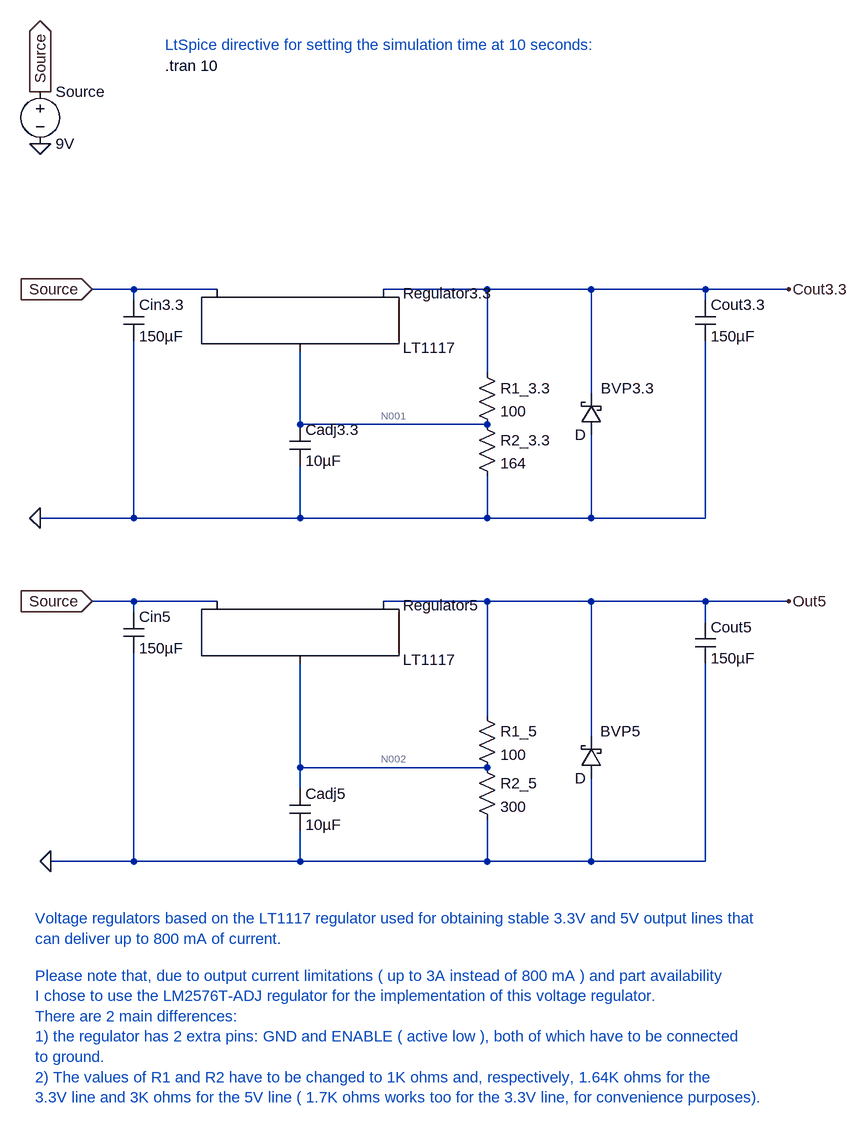
[diagram p0: schematic Voltage Regulator Model.asc]
Voltage Regulator Model.asc, the LTspice schematic file:
Version 4
SHEET 1 1356 680
WIRE 96 -592 32 -592
WIRE 224 -592 96 -592
WIRE 640 -592 480 -592
WIRE 800 -592 640 -592
WIRE 976 -592 800 -592
WIRE 1104 -592 976 -592
WIRE 96 -576 96 -592
WIRE 976 -576 976 -592
WIRE 640 -464 640 -592
WIRE 800 -432 800 -592
WIRE 352 -384 352 -496
WIRE 640 -384 352 -384
WIRE 96 -240 96 -512
WIRE 96 -240 -48 -240
WIRE 352 -240 352 -320
WIRE 352 -240 96 -240
WIRE 640 -240 640 -304
WIRE 640 -240 352 -240
WIRE 800 -240 800 -368
WIRE 800 -240 640 -240
WIRE 976 -240 976 -512
WIRE 976 -240 800 -240
WIRE 96 -112 32 -112
WIRE 224 -112 96 -112
WIRE 640 -112 480 -112
WIRE 800 -112 640 -112
WIRE 976 -112 800 -112
WIRE 1104 -112 976 -112
WIRE 96 -96 96 -112
WIRE 976 -80 976 -112
WIRE 640 64 640 -112
WIRE 800 96 800 -112
WIRE 352 144 352 -16
WIRE 640 144 352 144
WIRE 352 176 352 144
WIRE 96 288 96 -32
WIRE 96 288 -32 288
WIRE 352 288 352 240
WIRE 352 288 96 288
WIRE 640 288 640 224
WIRE 640 288 352 288
WIRE 800 288 800 160
WIRE 800 288 640 288
WIRE 976 288 976 -16
WIRE 976 288 800 288
FLAG 1104 -592 Cout3.3
FLAG -48 -816 0
FLAG -48 -896 Source
IOPIN -48 -896 Out
FLAG 32 -592 Source
IOPIN 32 -592 In
FLAG -48 -240 0
FLAG 32 -112 Source
IOPIN 32 -112 In
FLAG -32 288 0
FLAG 1104 -112 Out5
SYMBOL voltage -48 -912 R0
WINDOW 123 0 0 Left 0
WINDOW 39 0 0 Left 0
SYMATTR InstName Source
SYMATTR Value 9V
SYMBOL PowerProducts\\LT1117 352 -592 R0
SYMATTR InstName Regulator3.3
SYMBOL res 624 -480 R0
SYMATTR InstName R1_3.3
SYMATTR Value 100
SYMBOL res 624 -400 R0
SYMATTR InstName R2_3.3
SYMATTR Value 164
SYMBOL schottky 816 -368 R180
WINDOW 0 -80 72 Left 2
WINDOW 3 24 0 Left 2
SYMATTR InstName BVP3.3
SYMBOL cap 960 -576 R0
SYMATTR InstName Cout3.3
SYMATTR Value 150µF
SYMBOL cap 336 -384 R0
SYMATTR InstName Cadj3.3
SYMATTR Value 10µF
SYMBOL cap 80 -576 R0
SYMATTR InstName Cin3.3
SYMATTR Value 150µF
SYMBOL PowerProducts\\LT1117 352 -112 R0
SYMATTR InstName Regulator5
SYMBOL schottky 816 160 R180
WINDOW 0 -59 72 Left 2
WINDOW 3 24 0 Left 2
SYMATTR InstName BVP5
SYMBOL res 624 128 R0
SYMATTR InstName R2_5
SYMATTR Value 300
SYMBOL res 624 48 R0
SYMATTR InstName R1_5
SYMATTR Value 100
SYMBOL cap 336 176 R0
SYMATTR InstName Cadj5
SYMATTR Value 10µF
SYMBOL cap 80 -96 R0
SYMATTR InstName Cin5
SYMATTR Value 150µF
SYMBOL cap 960 -80 R0
SYMATTR InstName Cout5
SYMATTR Value 150µF
TEXT 144 -936 Left 2 !.tran 10
TEXT 144 -968 Left 2 ;LtSpice directive for setting the simulation time at 10 seconds:
TEXT -56 376 Left 2 ;Voltage regulators based on the LT1117 regulator used for obtaining stable 3.3V and 5V output lines that\ncan deliver up to 800 mA of current.
TEXT -56 464 Left 2 ;Please note that, due to output current limitations ( up to 3A instead of 800 mA ) and part availability\nI chose to use the LM2576T-ADJ regulator for the implementation of this voltage regulator.\nThere are 2 main differences:\n1) the regulator has 2 extra pins: GND and ENABLE ( active low ), both of which have to be connected\nto ground.\n2) The values of R1 and R2 have to be changed to 1K ohms and, respectively, 1.64K ohms for the \n3.3V line and 3K ohms for the 5V line ( 1.7K ohms works too for the 3.3V line, for convenience purposes).

The netlist it stands for:
* Voltage Regulator Model.asc
V§Source Source 0 9V
XRegulator3.3 N001 Cout3.3 Source LT1117
R1_3.3 Cout3.3 N001 100
R2_3.3 N001 0 164
D§BVP3.3 0 Cout3.3 D
Cout3.3 Cout3.3 0 150µF
Cadj3.3 N001 0 10µF
Cin3.3 Source 0 150µF
XRegulator5 N002 Out5 Source LT1117
D§BVP5 0 Out5 D
R2_5 N002 0 300
R1_5 Out5 N002 100
Cadj5 N002 0 10µF
Cin5 Source 0 150µF
Cout5 Out5 0 150µF
.model D D
.lib standard.dio
.tran 10
* LtSpice directive for setting the simulation time at 10 seconds:
* Voltage regulators based on the LT1117 regulator used for obtaining stable 3.3V and 5V output lines that
* can deliver up to 800 mA of current.
* Please note that, due to output current limitations ( up to 3A instead of 800 mA ) and part availability
* I chose to use the LM2576T-ADJ regulator for the implementation of this voltage regulator.
* There are 2 main differences:
* 1) the regulator has 2 extra pins: GND and ENABLE ( active low ), both of which have to be connected
* to ground.
* 2) The values of R1 and R2 have to be changed to 1K ohms and, respectively, 1.64K ohms for the
* 3.3V line and 3K ohms for the 5V line ( 1.7K ohms works too for the 3.3V line, for convenience purposes).
.lib LT1117.lib
.backanno
.end

* Results of the author's LTspice run, read from the files saved beside the schematic
* Operating Point, zero values left out:
*   V(source) = 9 V
*   V(n001) = 2.075 V
*   V(cout3.3) = 3.334 V
*   V(n002) = 3.795 V
*   V(out5) = 5.054 V
*   I(Bvp5) = -5.064 pA
*   I(Bvp3.3) = -3.344 pA
*   I(R1_5) = 12.59 mA
*   I(R2_5) = 12.65 mA
*   I(R2_3.3) = 12.65 mA
*   I(R1_3.3) = 12.6 mA
*   I(Source) = -25.3 mA
*   Ix(regulator3.3:1) = -55 µA
*   Ix(regulator3.3:2) = -12.6 mA
*   Ix(regulator3.3:3) = 12.65 mA
*   Ix(regulator5:1) = -55 µA
*   Ix(regulator5:2) = -12.59 mA
*   Ix(regulator5:3) = 12.65 mA